# EAGLE design pc_tinyGSR (EAGLE 9.6.2)
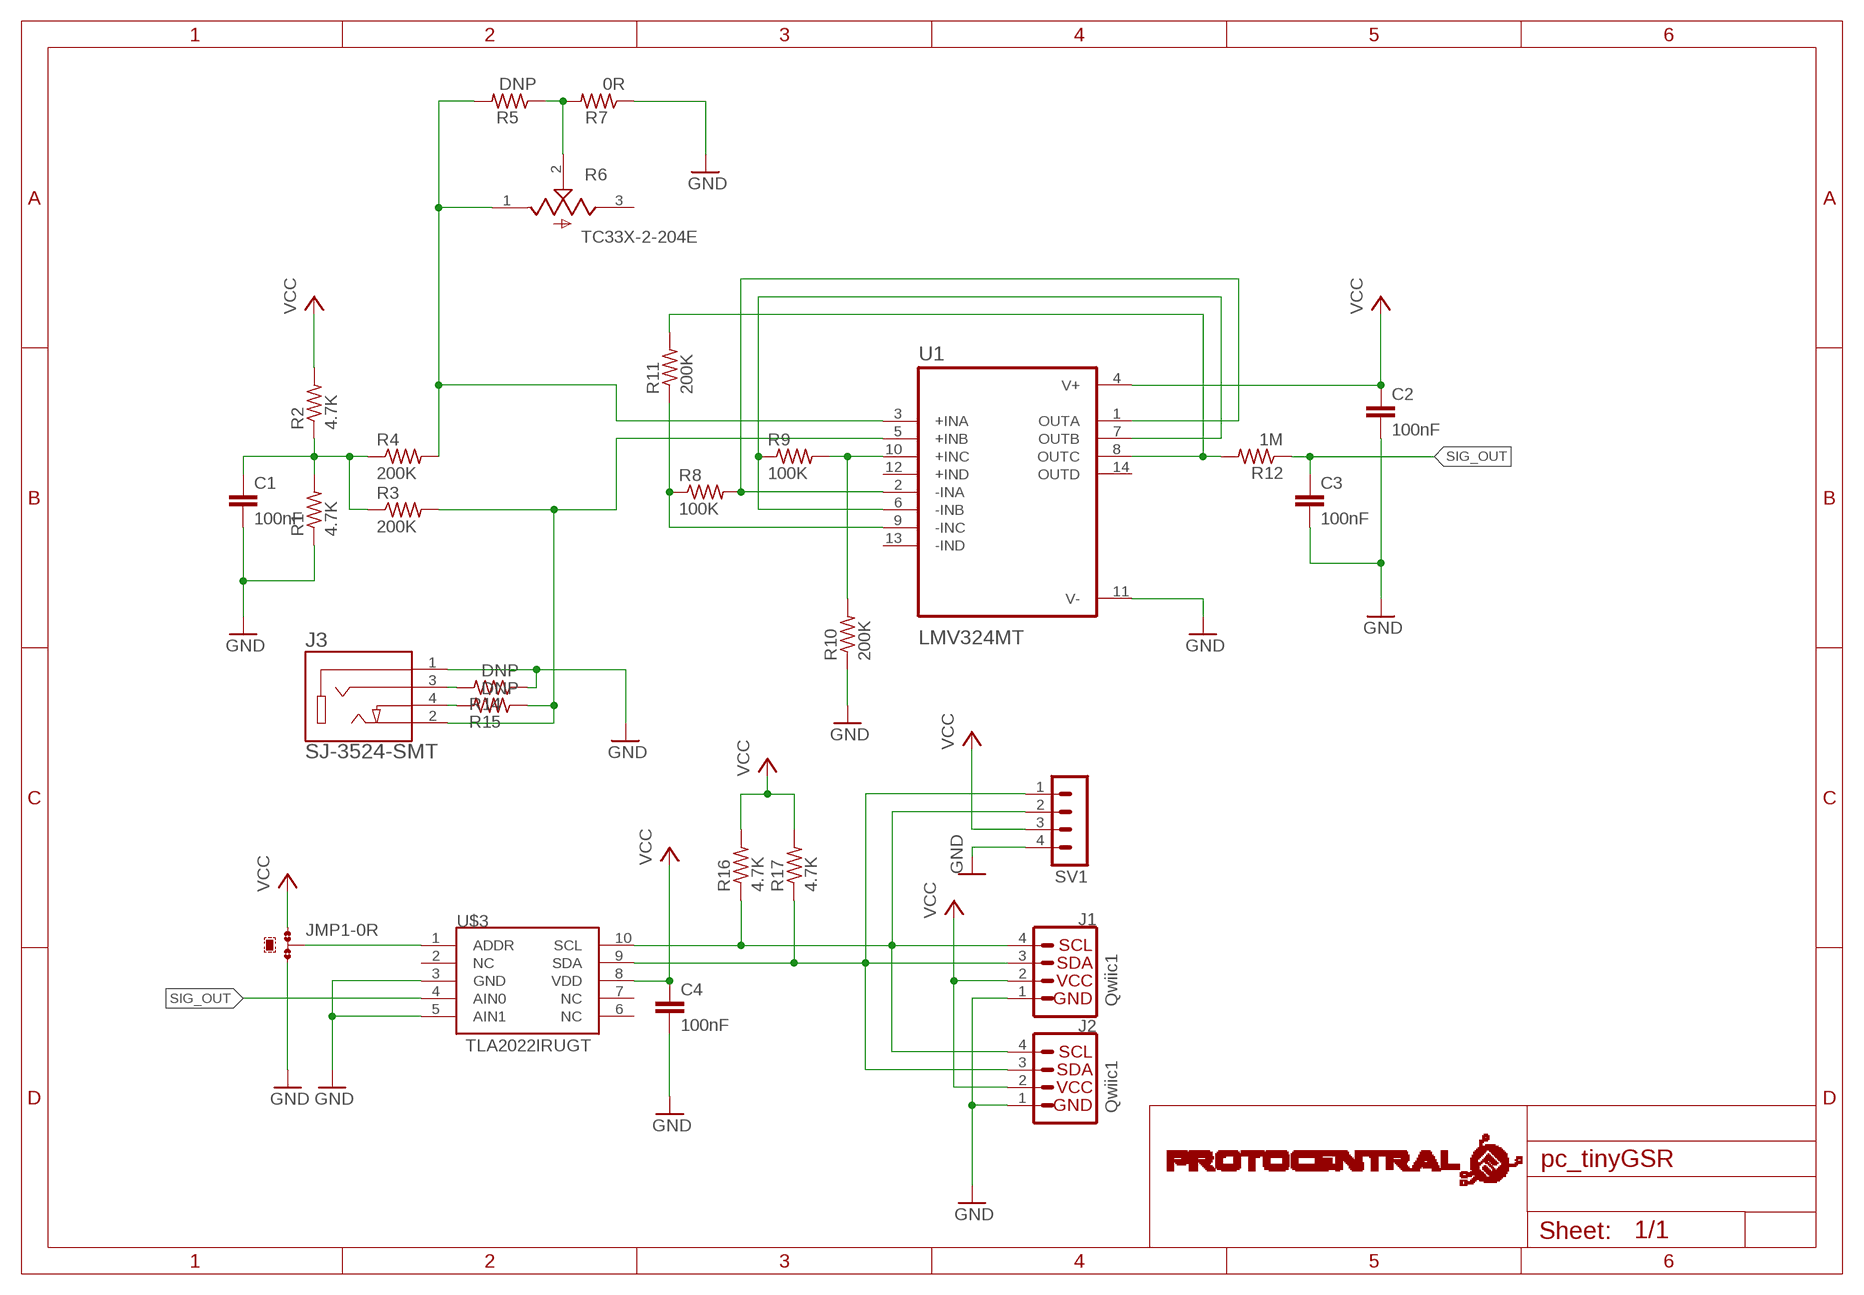
[diagram p0: schematic, sheet 1]

## Parts
C1  100nF  C-EUC0402  [C0402]
C2  100nF  C-EUC0402  [C0402]
C3  100nF  C-EUC0402  [C0402]
C4  100nF  C-EUC0402  [C0402]
J1  Qwiic1  QWIIC_CONNECTORJS-1MM  [1X04_1MM_RA]
J2  Qwiic1  QWIIC_CONNECTORJS-1MM  [1X04_1MM_RA]
J3  SJ-3524-SMT  [CUI_SJ-3524-SMT]
JMP1  0R-JUMPA  [A0R-JMP]
R1  4.7K  R-US_R0402  [R0402]
R2  4.7K  R-US_R0402  [R0402]
R3  200K  R-US_R0402  [R0402]
R4  200K  R-US_R0402  [R0402]
R5  DNP  R-US_R0402  [R0402]
R6  TC33X-2-204E  [TRIM_TC33X-2-204E]
R7  0R  R-US_R0402  [R0402]
R8  100K  R-US_R0402  [R0402]
R9  100K  R-US_R0402  [R0402]
R10  200K  R-US_R0402  [R0402]
R11  200K  R-US_R0402  [R0402]
R12  1M  R-US_R0402  [R0402]
R14  DNP  R-US_R0402  [R0402]
R15  DNP  R-US_R0402  [R0402]
R16  4.7K  R-US_R0402  [R0402]
R17  4.7K  R-US_R0402  [R0402]
SV1  MA04-1  [MA04-1]
U1  LMV324MT  [SOP65P640X120-14N]
U$1  PROTY_LOGO_WITH_TEXT  [PROTY_WITH_TEXT]
U$3  TLA2022IRUGT  [QFN50P200X150X40-10N]

## Nets
GND: C1.2 C2.2 C3.2 C4.2 J1.1 J2.1 J3.1 JMP1.3 R1.1 R7.1 R10.1 R14.1 SV1.4 U1.11(V-) U$3.3(GND) U$3.5(AIN1)
N$1: R5.1 R6.2(W) R7.2
N$2: J3.2 R3.2 R15.1 U1.5(+INB)
N$3: C1.1 R1.2 R2.1 R3.1 R4.1
N$4: R8.1 R11.1 U1.9(-INC)
N$5: R4.2 R5.2 R6.1(CCW) U1.3(+INA)
N$6: R8.2 U1.1(OUTA) U1.2(-INA)
N$7: R9.1 U1.6(-INB) U1.7(OUTB)
N$8: R9.2 R10.2 U1.10(+INC)
N$9: R11.2 R12.2 U1.8(OUTC)
N$11: JMP1.2 U$3.1(ADDR)
N$12: J1.4 J2.4 R16.1 SV1.2 U$3.10(SCL)
N$13: J1.3 J2.3 R17.1 SV1.1 U$3.9(SDA)
N$14: J3.3 R14.2
N$15: J3.4 R15.2
SIG_OUT: C3.1 R12.1 U$3.4(AIN0)
VCC: C2.1 C4.1 J1.2 J2.2 JMP1.1 R2.2 R16.2 R17.2 SV1.3 U1.4(V+) U$3.8(VDD)
Unconnected: R6.3(CW) U1.12(+IND) U1.13(-IND) U1.14(OUTD) U$3.2(NC) U$3.6(NC) U$3.7(NC)

## Library data of the parts
C1-C4 = rcl:C-EU: CAPACITOR, European symbol; SPICEPREFIX: C
J1 J2 = SparkFun-Connectors:QWIIC_CONNECTOR: SparkFun I2C Standard Qwiic Connector An SMD 1mm pitch JST connector makes it easy and quick (get it? Qwiic?) to connect I2C devices to each other. The Qwiic system <http://www.sparkfun.com/qwiic> enables fast and solderless connection between popular platforms and various sensors and actuators. We carry 200mm <https://www.sparkfun.com/products/14204>, 100mm <https://www.sparkfun.com/products/14205>, 50mm <https://www.sparkfun.com/products/14206>, and breadboard friendly <https://www.sparkfun.com/products/14207> Qwiic cables. We also offer 10 pcs strips <https://www.sparkfun.com/products/14323> the SMD connectors.; PROD_ID: CONN-13694
J3 = circuitects:SJ-3524-SMT: Audio Jack Connector 3.5 mm Low Profile Surface Mount Stereo Jack, 4 Pin Right-Angle Check prices <https://pricing.snapeda.com/parts/SJ-3524-SMT-TR/CUI%20Devices/view-part?ref=eda>; AVAILABILITY: Good; CUI_PURCHASE_URL: https://www.cuidevices.com/product/interconnect/connectors/audio-connectors/jacks/sj-352x-smt-series?utm_source=snapeda.com&utm_medium=referral&utm_campaign=snapedaBOM; DESCRIPTION: 3.5 mm, Stereo, Right Angle, Surface Mount (SMT), 3 Conductors, 0~1 Internal Switches, Audio Jack Connector; MF: CUI Devices; MP: SJ-3524-SMT-TR; PACKAGE: None; PRICE: None
JMP1 = jump-0r-smd:0R-JUMP: SMD 0R 0805 Jumper
R1-R5 R7-R12 R14-R17 = rcl:R-US_: RESISTOR, American symbol; SPICEPREFIX: R
R6 = circuitects:TC33X-2-204E: Res Trimmer 100K Ohm 25% 1/10W 1(Elec)/1(Mech)Turn (3 X 3.8mm) Foot Print SMD Embossed T/R Check prices <https://pricing.snapeda.com/parts/TC33X-2-204E/Bourns/view-part?ref=eda>; AVAILABILITY: Good; DESCRIPTION: 200 kOhms 0.1W, 1/10W J Lead Surface Mount Trimmer Potentiometer Cermet 1 Turn Top Adjustment; MF: Bourns; MP: TC33X-2-204E; PACKAGE: 3224X Bourns; PRICE: None
SV1 = con-lstb:MA04-1: PIN HEADER; OC_FARNELL: unknown; OC_NEWARK: unknown
U1 = circuitects:LMV324MT; AVAILABILITY: Unavailable; DESCRIPTION: Quad channel general purpose, low voltage, rail-to-rail output operational amplifiers 14-TSSOP -40 to 125; MF: Texas Instruments; MP: LMV324MT/NOPB; PACKAGE: TSSOP-14 Texas Instruments; PRICE: None; PURCHASE-URL: https://pricing.snapeda.com/search/part/LMV324MT/NOPB/?ref=eda
U$1 = circuitects:PROTY_LOGO_WITH_TEXT
U$3 = circuitects:TLA2022IRUGT

## Net classes
2 gnd: width 0.102 mm, drill 0.1 mm

## Board
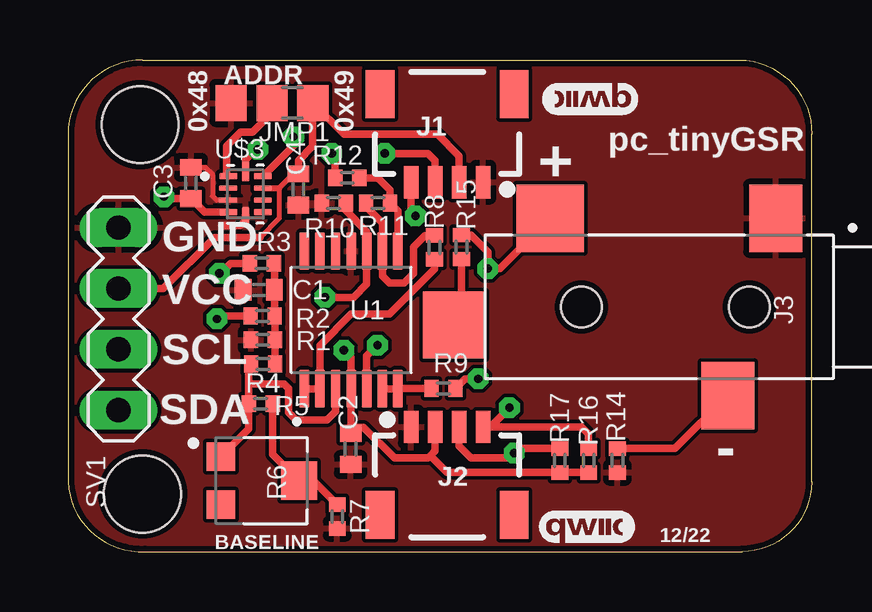
[diagram p1: board, top side]
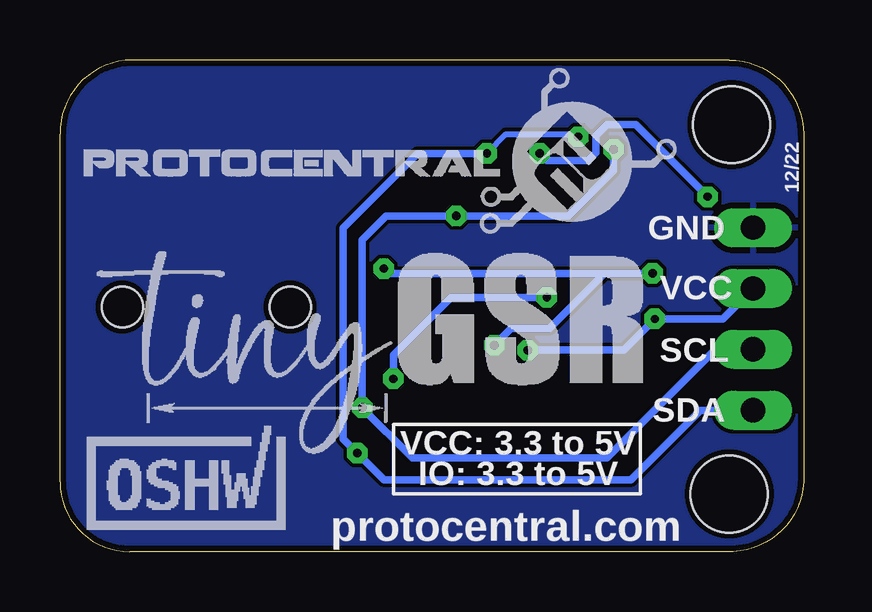
[diagram p2: board, bottom side, seen from below]

Size 31 x 20.5 mm. Coordinates in mm from the lower left corner, seen from the top.
Outline: 3.2,0 28.1,0 arc90 31,2.9 31,17.4 arc90 28,20.5 3.1,20.5 arc90 0,17.4 0,2.9 arc90 3.2,0
Copper layers (1*2*15*16): Top 0.035mm / dielectric 1.5mm / Route2 0.035mm / dielectric 0.15mm / Route15 0.035mm / dielectric 0.2mm / Bottom 0.035mm
Design rules "Circuitects-Rules": minimum track width 6mil, minimum drill 0.3mm, track to track 6mil, track to pad 6mil, pad to pad 6mil, via to via 6mil, smd to smd 6mil, copper to edge 10mil, drill to drill 8mil, minimum pad ring 12mil, minimum via ring 10mil, stop-mask expansion 4mil, vias tented up to drill 25mil, thermal gap 10mil
Holes 3.2 mm at 3.1,2.4 3,17.8

### Footprints (pad centres in the part's own frame; a part is rotated, then mirrored left to right if it is on the bottom)
C0402 = smd 0.7 x 0.9: 1 -0.65,0; 2 0.65,0
1X04_1MM_RA = smd 0.6 x 1.35: 1 -1.5,0; 2 -0.5,0; 3 0.5,0; 4 1.5,0 | smd 1.2 x 2: NC1 2.8,-3.675; NC2 -2.8,-3.675
CUI_SJ-3524-SMT = smd 2.2 x 2.8: 1 -1.1,-3.7; 3 0.9,3.7 | smd 2.8 x 2.8: 2 8.3,-3.7 | smd 2.6 x 2.8: 4 12.3,0.75 | hole 1.7: 0,0; 7,0
A0R-JMP = smd 1.5 x 1.3: 1 0,1.7; 2 0,0; 3 0,-1.7
R0402 = smd 0.6 x 0.7: 1 -0.5,0; 2 0.5,0
TRIM_TC33X-2-204E = smd 1.2 x 1.2: 1 -1.8,1; 3 -1.8,-1 | smd 1.5 x 1.6: 2 1.45,0
MA04-1 = drill 1.016 long: 1 -3.81,0; 2 -1.27,0; 3 1.27,0; 4 3.81,0
SOP65P640X120-14N = smd 1.57 x 0.41: 1 -2.87,1.95; 2 -2.87,1.3; 3 -2.87,0.65; 4 -2.87,0; 5 -2.87,-0.65; 6 -2.87,-1.3; 7 -2.87,-1.95; 8 2.87,-1.95; 9 2.87,-1.3; 10 2.87,-0.65; 11 2.87,0; 12 2.87,0.65; 13 2.87,1.3; 14 2.87,1.95
QFN50P200X150X40-10N = smd 0.76 x 0.27: 1 -0.72,0.75; 4 -0.72,-0.75; 6 0.72,-0.75; 9 0.72,0.75 | smd 0.76 x 0.22: 2 -0.72,0.25; 3 -0.72,-0.25; 7 0.72,-0.25; 8 0.72,0.25 | smd 0.32 x 0.81: 5 0,-0.945; 10 0,0.945

### Placement (x,y rotation side)
C1  7.95,10.91 180 top
C2  11.78,4.28 270 top
C3  5.12,15.37 90 top
C4  9.6,15.1 270 top
J1  15.8,15.4 180 top
J2  15.8,5.2 0 top
J3  28.4,10.2 180 top
JMP1  8.5,18.7 270 top
LOGO1  QWIIC_LOGO_4MM  [QWIIC_4MM]  21.64,1.02 0 top
LOGO3  QWIIC_LOGO_4MM  [QWIIC_4MM]  21.76,18.88 180 top
R1  8.12,8.83 0 top
R2  8.11,9.82 180 top
R3  8.08,12.02 180 top
R4  8.13,7.82 180 top
R5  8.03,6.17 180 top
R6  8.17,2.96 0 top
R7  11.22,1.46 90 top
R8  15.28,12.68 270 top
R9  15.65,6.8 0 top
R10  11.07,14.53 0 top
R11  12.92,14.53 0 top
R12  11.64,15.58 0 top
R14  22.9,3.8 90 top
R15  16.4,12.7 270 top
R16  21.7,3.8 270 top
R17  20.5,3.8 270 top
SV1  2.1,9.7 90 top
U1  11.8,9.66 90 top
U$1  30,13.62 0 bottom
U$2  [CERT-SMALL-SILK]  25.74,0.9 0 bottom
U$3  7.4,14.9 0 top
U$4  [TINYGSR]  31.6,2.7 0 bottom

### Tracks (layer width: path | path; a pad name or v marks a point on that pad's centre or on a via)
GND
  Top 0.2: U$3.3 6.19,14.65 6.02,14.82 6.02,15.72 5.72,16.02 C3.2
  Top 0.305: U$3.5 7.4,13.8 7.2,13.6 6.4,13.6
  pour Bottom: 0,-0.2 30.9,-0.2 30.9,20.5 0,20.5
  pour Top: 0,-0.2 30.9,-0.2 30.9,20.5 0,20.5
N$1
  Top 0.305: R5.1 8.53,4.05 R6.2 10.22,2.96 R7.2
N$2  (via drill 0.35)
  Top 0.305: 19.4,13.2 J3.2 18,11.8 v17.5,11.8 17.5,12.5 16.8,13.2 R15.1 | R3.2 6.78,12.02 6.36,11.6 v6.3,11.6 | U1.5 12.45,8.15 v12.9,8.6
  Bottom 0.305: v6.3,11.6 8.3,11.6 8.35,11.55 | 8.35,11.55 10.6,9.3 12.2,9.3 v12.9,8.6 | v17.5,11.8 17.3,11.6 8.4,11.6 8.35,11.55
N$3
  Top 0.305: R4.1 R1.2 R2.1 C1.1 8.6,12 R3.1
N$4
  Top 0.305: R8.1 14.88,13.18 14.4,12.7 14.4,11.6 14,11.2 13.4,11.2 13.1,11.5 U1.9 13.1,13.7 12.42,14.38 R11.1
N$5
  Top 0.305: 7.53,6.25 R5.2 | R5.2 7.53,5.12 R6.1 | R5.2 7.53,7 | 7.53,7 7.53,7.72 R4.2 | U1.3 11.15,5.85 10.8,5.5 9.5,5.5 9.2,5.8 9.2,6.8 9,7 7.53,7
N$6
  Top 0.305: U1.1 U1.2 10.5,8.6 11.8,9.9 13.4,9.9 15.28,11.78 R8.2
N$7
  Top 0.305: R9.1 U1.7 U1.6
N$8  (via drill 0.35)
  Top 0.305: R10.2 11.57,14.23 12.45,13.35 U1.10 12.45,11.15 11.9,10.6 v10.7,10.6 | R9.2 16.55,7.2 v17.1,7.2
  Bottom 0.305: v17.1,7.2 17.1,8.2 14.7,10.6 v10.7,10.6
N$9
  Top 0.305: U1.8 13.75,14.2 R11.2 13.42,15.08 12.92,15.58 R12.2
N$11
  Top 0.305: JMP1.2 8.5,18.3 7.7,17.5 7.2,17.5 6.6,16.9 6.6,15.73 U$3.1
N$12  (via drill 0.35)
  Top 0.305: R16.1 21.7,4.9 21.4,5.2 J2.4 17.6,5.2 v18.4,6 | v14.48,14 14.3,14.18 J1.4 | v7.92,16.77 7.82,16.77 7.4,16.35 U$3.10
  Bottom 0.305: v7.92,16.77 7.92,15.88 9.8,14 v14.48,14 17.4,14 18.4,13 v18.4,6 16.3,3.9 8.2,3.9 3.67,8.43 SV1.2
N$13  (via drill 0.35)
  Top 0.305: J2.3 16.3,4.4 16.8,3.9 18.4,3.9 v18.6,4.1 18.8,4.3 R17.1 | J1.3 15.3,16.3 15,16.6 v13.2,16.6 | U$3.9 9.4,16.93 v9.4,17.3
  Bottom 0.254: v9.4,17.3 9.5,17.4 12.4,17.4 v13.2,16.6
  Bottom 0.305: SV1.1 4.31,5.89 7.2,3 17.5,3 v18.6,4.1 19.2,4.7 19.2,13.5 16.1,16.6 v13.2,16.6
N$14
  Top 0.305: J3.3 25.3,4.3 R14.2
N$15
  Top 0.305: R15.2 16.4,9.75 J3.4
SIG_OUT  (via drill 0.35)
  Top 0.305: U$3.4 5.69,14.15 C3.1 4.08,14.72 v4,14.8 | R12.1 11.14,16.46 v11,16.6
  Bottom 0.305: v4,14.8 7,17.8 8.2,17.8 8.67,17.33 8.67,16.63 9,16.3 10.7,16.3 v11,16.6
VCC  (via drill 0.35)
  Top 0.2: 9.2,15.55 8.8,15.15 8.8,13.9 8,13.1
  Top 0.254: U$3.8 8.8,15.15 | 9.2,15.55 9.4,15.55 C4.1
  Top 0.305: 11.82,4.98 12.03,5.18 12.32,5.18 13.6,3.9 15,3.9 15.1,4 | 11.82,4.98 C2.1 | J2.2 15.3,4.2 15.1,4 | 11.82,4.98 11.53,4.98 11.8,5.25 U1.4 11.8,8.1 v11.5,8.4 | R16.2 R17.2 15.8,3.3 15.1,4 | J1.2 16.3,16.5 15.4,17.4 11.5,17.4 JMP1.1 10.2,16.9 9.6,16.3 C4.1 | 8,13.1 6.1,13.1 3.97,10.97 SV1.3 | R2.2 6.32,9.82 v6.2,9.7
  Bottom 0.305: v11.5,8.4 7.5,8.4 v6.2,9.7 3.37,9.7 SV1.3

### Text on the board
tPlace: ADDR | 0x48 | 0x49 | + | pc_tinyGSR | GND | VCC | SCL | SDA | - | 12/22 | BASELINE
bPlace: 12/22 | GND | VCC | SCL | SDA | VCC: 3.3 to 5V / IO: 3.3 to 5V | protocentral.com